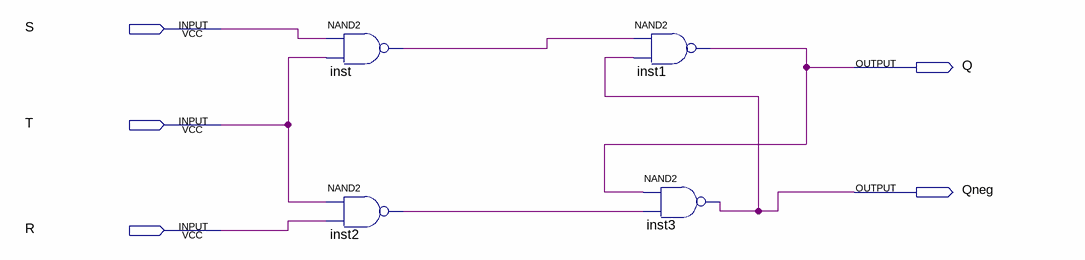
[diagram p0: schematic sheet]
// Quartus schematic RST.bdf as structural Verilog: 4 symbols, 5 pins
module RST (
  input  S,
  input  T,
  input  R,
  output Q,
  output Qneg
);

  wire inst2_out, inst_out;

  nand inst (inst_out, S, T);
  nand inst2 (inst2_out, T, R);
  nand inst1 (Q, inst_out, Qneg);
  nand inst3 (Qneg, Q, inst2_out);
endmodule
